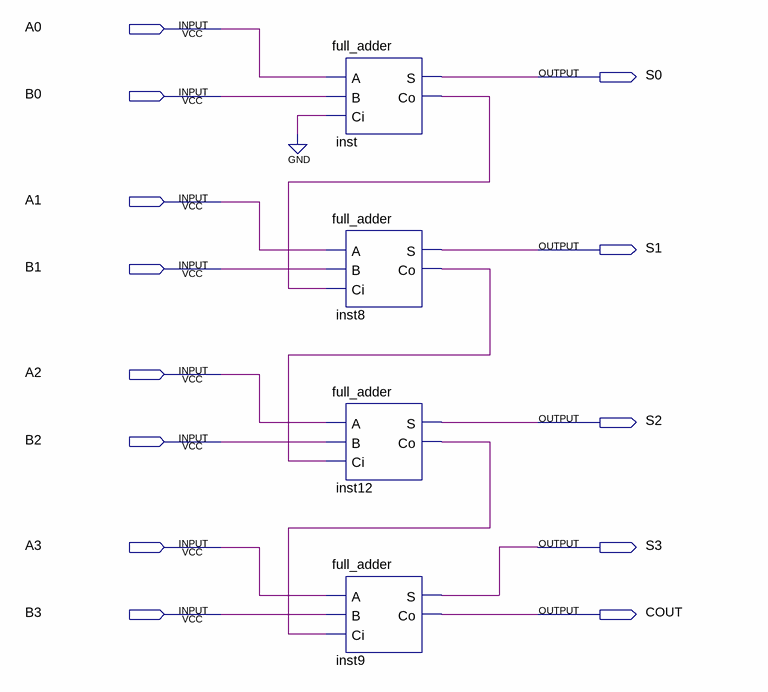
[diagram p0: schematic sheet]
// Quartus schematic full_adder4.bdf as structural Verilog: 4 symbols, 13 pins
module full_adder4 (
  input  A0,
  input  B0,
  input  A1,
  input  B1,
  input  A2,
  input  B2,
  input  A3,
  input  B3,
  output S0,
  output S1,
  output S2,
  output S3,
  output COUT
);

  wire inst8_co, inst12_co, inst_co;

  full_adder inst (.A(A0), .B(B0), .Ci(1'b0), .S(S0), .Co(inst_co));
  full_adder inst8 (.A(A1), .B(B1), .Ci(inst_co), .S(S1), .Co(inst8_co));
  full_adder inst12 (.A(A2), .B(B2), .Ci(inst8_co), .S(S2), .Co(inst12_co));
  full_adder inst9 (.A(A3), .B(B3), .Ci(inst12_co), .S(S3), .Co(COUT));
endmodule
